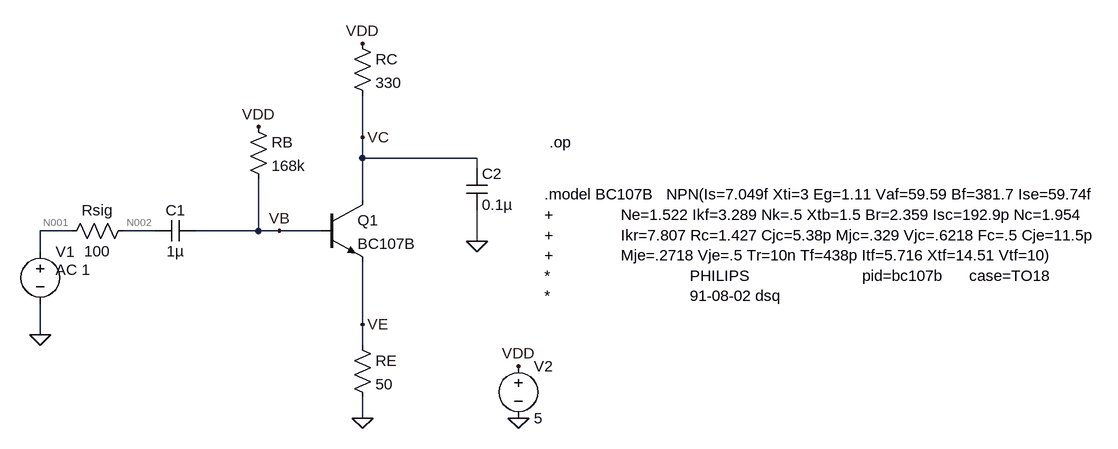
[diagram p0: schematic Homework3_BJT_DC_Polarisation.asc]
Homework3_BJT_DC_Polarisation.asc, the LTspice schematic file:
Version 4
SHEET 1 1240 4152
WIRE -96 -320 -96 -384
WIRE -96 -288 -96 -320
WIRE 80 -288 -96 -288
WIRE 80 -272 80 -288
WIRE -96 -224 -96 -288
WIRE -544 -176 -592 -176
WIRE -416 -176 -464 -176
WIRE -256 -176 -256 -256
WIRE -256 -176 -352 -176
WIRE -224 -176 -256 -176
WIRE -160 -176 -224 -176
WIRE 80 -160 80 -208
WIRE -592 -144 -592 -176
WIRE -96 -32 -96 -128
WIRE -592 -16 -592 -64
WIRE -96 0 -96 -32
WIRE -96 112 -96 80
FLAG -592 -16 0
FLAG -96 112 0
FLAG 80 -160 0
FLAG 144 112 0
FLAG 144 32 VDD
FLAG -96 -464 VDD
FLAG -256 -336 VDD
FLAG -224 -176 VB
FLAG -96 -32 VE
FLAG -96 -320 VC
SYMBOL npn -160 -224 R0
SYMATTR InstName Q1
SYMATTR Value BC107B
SYMBOL cap -352 -192 R90
WINDOW 0 0 32 VBottom 2
WINDOW 3 32 32 VTop 2
SYMATTR InstName C1
SYMATTR Value 1µ
SYMBOL res -448 -192 R90
WINDOW 0 0 56 VBottom 2
WINDOW 3 32 56 VTop 2
SYMATTR InstName Rsig
SYMATTR Value 100
SYMBOL res -272 -352 R0
SYMATTR InstName RB
SYMATTR Value 168k
SYMBOL res -112 -480 R0
SYMATTR InstName RC
SYMATTR Value 330
SYMBOL res -112 -16 R0
SYMATTR InstName RE
SYMATTR Value 50
SYMBOL cap 64 -272 R0
SYMATTR InstName C2
SYMATTR Value 0.1µ
SYMBOL voltage -592 -160 R0
WINDOW 123 24 44 Left 2
WINDOW 39 0 0 Left 0
SYMATTR InstName V1
SYMATTR Value ""
SYMATTR Value2 AC 1
SYMBOL voltage 144 16 R0
WINDOW 123 0 0 Left 0
WINDOW 39 0 0 Left 0
SYMATTR InstName V2
SYMATTR Value 5
TEXT 184 -232 Left 2 !.model BC107B   NPN(Is=7.049f Xti=3 Eg=1.11 Vaf=59.59 Bf=381.7 Ise=59.74f\n+               Ne=1.522 Ikf=3.289 Nk=.5 Xtb=1.5 Br=2.359 Isc=192.9p Nc=1.954\n+               Ikr=7.807 Rc=1.427 Cjc=5.38p Mjc=.329 Vjc=.6218 Fc=.5 Cje=11.5p\n+               Mje=.2718 Vje=.5 Tr=10n Tf=438p Itf=5.716 Xtf=14.51 Vtf=10)\n*                               PHILIPS                         pid=bc107b      case=TO18\n*                               91-08-02 dsq
TEXT 192 -312 Left 2 !.op

The netlist it stands for:
* Homework3_BJT_DC_Polarisation.asc
Q1 VC VB VE 0 BC107B
C1 VB N002 1µ
Rsig N002 N001 100
RB VDD VB 168k
RC VDD VC 330
RE VE 0 50
C2 VC 0 0.1µ
V1 N001 0 AC 1
V2 VDD 0 5
.model NPN NPN
.model PNP PNP
.lib standard.bjt
.model BC107B   NPN(Is=7.049f Xti=3 Eg=1.11 Vaf=59.59 Bf=381.7 Ise=59.74f
+               Ne=1.522 Ikf=3.289 Nk=.5 Xtb=1.5 Br=2.359 Isc=192.9p Nc=1.954
+               Ikr=7.807 Rc=1.427 Cjc=5.38p Mjc=.329 Vjc=.6218 Fc=.5 Cje=11.5p
+               Mje=.2718 Vje=.5 Tr=10n Tf=438p Itf=5.716 Xtf=14.51 Vtf=10)
*                               PHILIPS                         pid=bc107b      case=TO18
*                               91-08-02 dsq
.op
.backanno
.end

* Results of the author's LTspice run, read from the files saved beside the schematic
* Operating Point:
*   V(vc) = 2.589 V
*   V(vb) = 1.081 V
*   V(ve) = 366.4 mV
*   V(n002) = 0 V
*   V(n001) = 0 V
*   V(vdd) = 5 V
*   Ic(Q1) = 7.305 mA
*   Ib(Q1) = 23.32 µA
*   Ie(Q1) = -7.328 mA
*   I(C2) = 0 A
*   I(C1) = 0 A
*   I(Re) = 7.328 mA
*   I(Rc) = 7.305 mA
*   I(Rb) = 23.32 µA
*   I(Rsig) = 0 A
*   I(V2) = -7.328 mA
*   I(V1) = 0 A
* From the log:
*   Semiconductor Device Operating Points:
*                           --- Bipolar Transistors ---
*   Name:       q1
*   Model:    bc107b
*   Ib:       2.33e-05
*   Ic:       7.30e-03
*   Vbe:      7.15e-01
*   Vbc:     -1.51e+00
*   Vce:      2.22e+00
*   BetaDC:   3.13e+02
*   Gm:       2.82e-01
*   Rpi:      1.19e+03
*   Rx:       0.00e+00
*   Ro:       8.36e+03
*   Cbe:      1.44e-10
*   Cbc:      3.59e-12
*   Cjs:      0.00e+00
*   BetaAC:   3.35e+02
*   Cbx:      0.00e+00
*   Ft:       3.03e+08